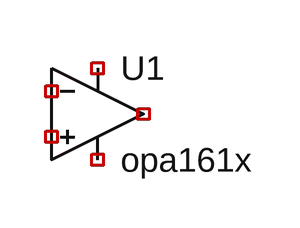
[diagram p0: schematic OPA161x.asy.asc]
OPA161x.asy.asc, the LTspice schematic file:
Version 4
SHEET 1 880 680
SYMBOL OpAmps\\opamp2 208 96 R0
SYMATTR InstName U1
SYMATTR Value opa161x
SYMATTR SpiceModel Z:\home\frohro\Classes\Electronics\2023 SDR\SDR 2023 Docs\OPA161x.LIB

The netlist it stands for:
* OPA161x.asy.asc
XU1 NC_01 NC_02 NC_03 NC_04 NC_05 opa161x  ; pins In+ In- V+ V- OUT
.lib Z:\home\frohro\Classes\Electronics\2023 SDR\SDR 2023 Docs\OPA161x.LIB
.backanno
.end